# Altium schematic sheet Sheet1.SchDoc
size A4; SheetNumber: 1; SheetTotal: 1
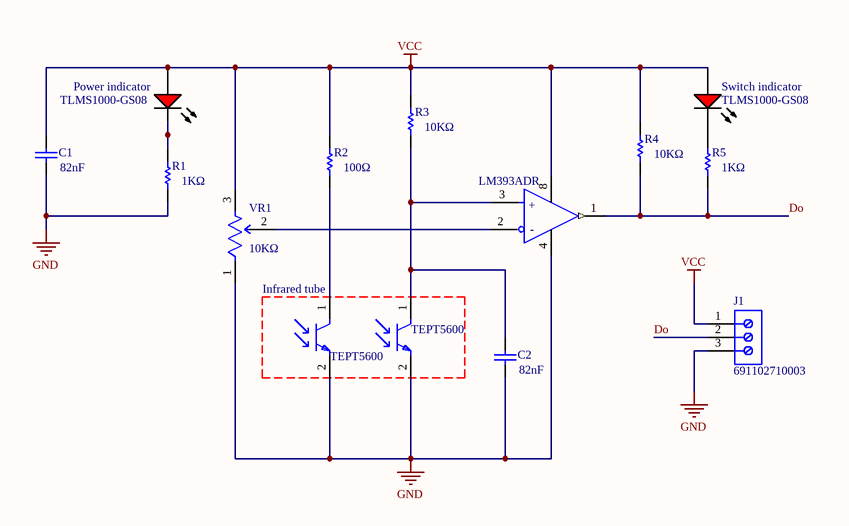
[diagram p0: Sheet1.SchDoc]

## Parts
B1  TEPT5600  [FP-6_544-5185_03-4-MFG]
C1  Capacitance: 82nF  [CAPC2013X135X45ML10T25]  (hidden comment: GRM21BR71H104KA01L)
C2  Capacitance: 82nF  [CAPC2013X135X45ML10T25]  (hidden comment: GRM21BR71H104KA01L)
J1  691102710003  [691102710003]
N1  TEPT5600  [FP-6_544-5185_03-4-MFG]
Power_indicator  TLMS1000-GS08  [VISH-TLMS1000_V]
R1  Resistance: 1KΩ  [RESC1005X40X25LL05T05]  (hidden comment: ERJ2GE0R00X)
R2  Resistance: 100Ω  [RESC1005X40X25LL05T05]  (hidden comment: ERJ2GE0R00X)
R3  Resistance: 10KΩ  [RESC1005X40X25LL05T05]  (hidden comment: ERJ2GE0R00X)
R4  Resistance: 10KΩ  [RESC1005X40X25LL05T05]  (hidden comment: ERJ2GE0R00X)
R5  Resistance: 1KΩ  [RESC1005X40X25LL05T05]  (hidden comment: ERJ2GE0R00X)
Switch_indicator  TLMS1000-GS08  [VISH-TLMS1000_V]
U?  LM393ADR  [FP-D0008A-MFG]  (part A of 2)
VR1  Resistance: 10KΩ  [FP-3362P-MFG]  (hidden comment: 3362P-1-252LF)

## Blocks framed on the sheet
Infrared tube: B1 N1

## Nets
GND: B1.2(E) C1.1 C2.1 J1.3 N1.2(E) R1.1 U?.4(GND) VR1.1(CCW)
VCC: C1.2 J1.1 Power_indicator.1(A) R2.2 R3.2 R4.2 Switch_indicator.1(A) U?.8(VCC) VR1.3(CW)
Do: J1.2 R4.1 R5.1 U?.1(1OUT)
NetB1_1: B1.1(C) C2.2 R3.1 U?.3(1IN+)
NetN1_1: N1.1(C) R2.1
NetPower_indicator_2: Power_indicator.2(K) R1.2
NetR5_2: R5.2 Switch_indicator.2(K)
NetU?_2: U?.2(1IN-) VR1.2(WIPER)

## Notes on the sheet
- (in symbol CMP-04896-000011-1, part A) +; -

## Library data of the parts
B1 N1 = CMP-02533-000004-1: SENSOR PHOTO 570NM TOP VIEW RAD; Number of Channels: 1; Collector Emitter Voltage (VCEO): 6V; Output Type: Analog; Power Consumption: 100mW; Max Collector Current: 20mA; Lens Style: Domed; Polarity: NPN; Dark Current: 50nA; Viewing Angle: 20°; Operating Supply Voltage: 5V; Package Material: SILICON; Wavelength: 570nm; Width: 5.75mm; Power Dissipation: 100mW; Package Quantity: 4000; Radiation Hardening: No; RoHS Compliant: Yes; Lead Free: Lead Free; Max Power Dissipation: 100mW; Max Operating Temperature: 85°C; Length: 5.75mm; Case/Package: Radial; Number of Elements: 1; Number of Pins: 2; Min Operating Temperature: -40°C; Mount: Through Hole; Height: 8mm; Orientation: Top View; Series: -; Collector Emitter Breakdown Voltage: 6V; Packaging: Bulk
C1 C2 = CMP-2100-03644-1: Chip Capacitor, 0.1 uF, +/- 10%, 50 V, -55 to 125 degC, 0805 (2012 Metric), RoHS, Tape and Reel; Manufacturer: Murata; Voltage: 50V; Insulation Resistance: 10GR; Dielectric Material: Ceramic; Dielectric: X7R; Package Description: 2-Pin Surface Mount Device, Body 2 x 1.25 mm; Manufacturer URL: http://www.murata.com/; Case Code (Imperial): 0805; Datasheet URL: http://psearch.en.murata.com/capacitor/product/GRM21BR71H104KA01%23.pdf; Termination: SMD/SMT; Lead Free: LeadFree; Package Quantity: 1; Mount: SurfaceMount; REACH SVHC: Unknown; Thickness: 0.053inch; Height: 1.25mm; Case/Package: 0805; Voltage Rating: 50V; Width: 0.049inch; Case Code (Metric): 2012; Material: Ceramic; Min Operating Temperature: -55degC; RoHSCompliant: true; Datasheet Version: 42675.0; Voltage Rating (DC): 50V; Tolerance: 10%; Package Reference: 0805; Depth: 1.25mm; Length: 2mm; Max Operating Temperature: 125degC; Packaging: TapeandReel; Number of Pins: 2; Radiation Hardening: No
J1 = CMP-1502-03259-2: NexarPartId: 8917707; Current: 15A; Stripping Length: -6mm; Wire/Cable Gauge: 22AWG; Wire Gauge (Min): 14AWG; Pitch: 5.0038mm; Number of Positions Per Level: 3; Plating: Steel; Voltage Rating: 300V; Number of Levels: 1; RoHS: Compliant; Mount: Through Hole; Color: Blue; Length: 7.5mm; Packaging: Box; Min Operating Temperature: -40°C; Housing Material: Nylon; REACH SVHC: Unknown; Current Rating: 15A; Contact Material: Brass; Width: 16.2mm; Height: 13.4mm; Lead Pitch: 5mm; Number of Contacts: 3; Number of Pins: 3; Contact Plating: Tin; Voltage: 300V; Termination: Screw; Max Operating Temperature: 105°C; Wire Gauge (Max): 22AWG
Power_indicator Switch_indicator = CMP-2000-07254-1: Low Current LED, 40 mW, 1.8 V, -40 to 100 degC, 2-Pin SMD (0603), RoHS, Tape and Reel; Manufacturer: Vishay; Lens Shape: Rectangular; Automotive Qualification Standard: AEC-Q100; Wavelength Typ: 636nm; SVHC: ToBeAdvised; LED Colour: Red; Bulb Size: 1.6mmx0.8mm; Forward Voltage: 1.8V; Luminous Intensity: 4mcd; Forward Current If: 2mA; Viewing Angle: 80°; Datasheet Version: Rev. 1.7, 02/2011; Datasheet URL: https://datasheet.ciiva.com/5798/1698881-5798337.pdf; LED Mounting: SMD; Packaging: CutTape; Package Reference: TLMS1000; Manufacturer URL: http://www.vishay.com/; Mounting Technology: SurfaceMount; Product Range: -; Package Description: 2-Pin Surface Mount Device, Body 1.6 x 0.8 mm; MSL: MSL2-1year
R1-R5 = CMP-2000-07451-1: Chip Resistor, 0 Ohm, 0.1 W, -55 to 155 degC, 0402 (1005 Metric), RoHS, Tape and Reel; Manufacturer: Panasonic; Voltage Rating (DC): 50V; Temperature Coefficient: 600ppm/��C; Max Power Dissipation: 100mW; Tolerance: 5%; Number of Terminations: 2; Mount: SurfaceMount; Height: 0.35mm; Packaging: TapeandReel; Contact Plating: Tin; Manufacturer URL: http://www.panasonic.com/; Composition: ThickFilm; Max Operating Temperature: 155degC; REACH SVHC: NoSVHC; Case/Package: 0402; Package Reference: 402; Depth: 0.5mm; Package Description: 2-Pin Surface Mount Device, Body 1 x 0.5 mm; Datasheet URL: https://industrial.panasonic.com/cdbs/www-data/pdf/RDA0000/AOA0000C301.pdf; RoHSCompliant: True; Case Code (Imperial): 0402; Military Standard: Not; Min Operating Temperature: -55degC; Power Rating: 100mW; Datasheet Version: 03/2015; Length: 1mm; Case Code (Metric): 1005; Termination: SMD/SMT; Mounting Technology: SurfaceMount; Voltage Rating: 50V; Width: 0.02inch; Package Quantity: 1; Lead Free: LeadFree; Radiation Hardening: No
U? = CMP-04896-000011-1: IC DUAL DIFF COMPARATOR 8-SOIC; Manufacturer: Texas Instruments; Min Supply Voltage: 2V; Nominal Supply Current: 0.6mA; Input Offset Voltage: 1mV; Max Junction Temp: +150°C; Number Of Channels: 2; Max Supply Voltage: 30V; Input Bias Current: -0.025uA; Response Time: 1.3us; Standoff Height: 0.11mm; Voltage Gain: 200V/mV; Temperature Range High: +70°C; Package: D0008A; Digikey Description: IC DUAL DIFF COMPARATOR 8-SOIC; Height: 1.75mm; ComponentLink2URL: http://www.ti.com/lit/ds/symlink/lm393a.pdf; ComponentLink2Description: Datasheet; Mouser Description: Analog Comparators Dual Diff A Grade; Temperature: 0°C to +70°C; Ambient Temperature Range Low: 0°C; Device Class L3: Comparators; Octopart: https://octopart.com/lm393adr-texas+instruments-428362; Temperature Range Low: 0°C; RoHS: TRUE; Ambient Temperature Range High: +70°C; Device Class L1: Integrated Circuits (ICs); Device Class L2: Linear ICs; Category: IC; Manufacturer Part Number: LM393ADR; Automotive: No; Lead Free: Yes
VR1 = CMP-00059-10485830-1: 3362P-1-252LF 1/4" Sq, Thru-Hole, TRIMMER, 2.5 Kilohms, Cermet, Single Turn; Temperature Coefficient: 100ppm/°C; Power Rating: 500mW; Tolerance: 10%; Number of Turns: 1; Depth: 6.99mm; Min Operating Temperature: -55°C; Radiation Hardening: No; Max Operating Temperature: 125°C; Termination: Pin; NexarPartId: 10485830; Height: 4.699mm; Length: 6.6mm; RoHS: Compliant; Mount: Through Hole; Width: 6.604mm; Schedule B: 8533400080, 8533400080; REACH SVHC: No SVHC; Composition: Cermet; Max Power Dissipation: 500mW; Military Standard: Not